# Altium schematic sheet Sheet3.SchDoc
size A4
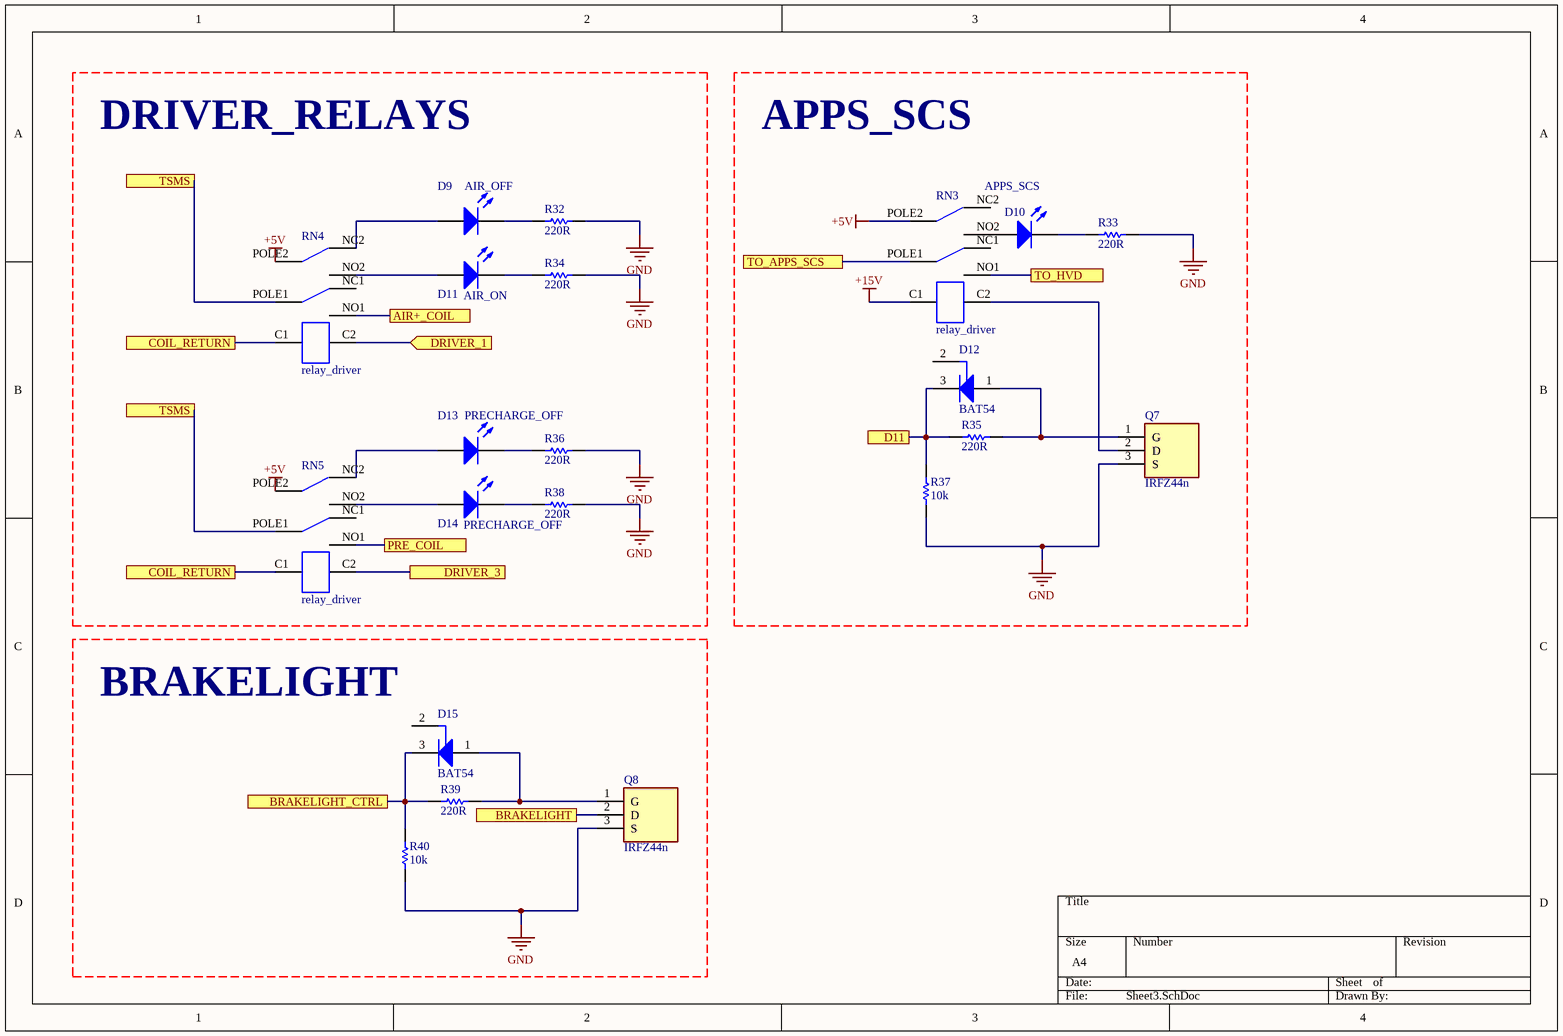
[diagram p0: Sheet3.SchDoc]

## Parts
D9  AIR_OFF  [3.2X1.6X1.1]
D10  APPS_SCS  [3.2X1.6X1.1]
D11  AIR_ON  [3.2X1.6X1.1]
D12  BAT54  [INF-SOT23_N]
D13  PRECHARGE_OFF  [3.2X1.6X1.1]
D14  PRECHARGE_OFF  [3.2X1.6X1.1]
D15  BAT54  [INF-SOT23_N]
Q7  IRFZ44n  [TO254P483X1016X2223-3P]
Q8  IRFZ44n  [TO254P483X1016X2223-3P]
R32  220R  [R1206]
R33  220R  [R1206]
R34  220R  [R1206]
R35  220R  [R1206]
R36  220R  [R1206]
R37  10k  [R1206]
R38  220R  [R1206]
R39  220R  [R1206]
R40  10k  [R1206]
RN3  relay_driver  [OMRON_12_RELAY]
RN4  relay_driver  [OMRON_12_RELAY]
RN5  relay_driver  [OMRON_12_RELAY]

## Blocks framed on the sheet
DRIVER_RELAYS: D9 D11 D13 D14 R32 R34 R36 R38 RN4 RN5
APPS_SCS: D10 D12 Q7 R33 R35 R37 RN3
BRAKELIGHT: D15 Q8 R39 R40

## Ports
AIR+_COIL, BRAKELIGHT, BRAKELIGHT_CTRL, COIL_RETURN, D11, DRIVER_1 (in), DRIVER_3, PRE_COIL, TO_APPS_SCS, TO_HVD, TSMS

## Nets
+5V: RN3.POLE2 RN4.POLE2 RN5.POLE2
+15V: RN3.C1
GND: Q7.3(S) Q8.3(S) R32.2 R33.2 R34.2 R36.2 R37.1 R38.2 R40.1
AIR+_COIL: RN4.NO1 ; port AIR+_COIL
BRAKELIGHT: Q8.2(D) ; port BRAKELIGHT
BRAKELIGHT_CTRL: D15.3(K) R39.1 R40.2 ; port BRAKELIGHT_CTRL
COIL_RETURN: RN4.C1 RN5.C1 ; port COIL_RETURN
D11: D12.3(K) R35.1 R37.2 ; port D11
DRIVER_1: RN4.C2 ; port DRIVER_1
DRIVER_3: RN5.C2 ; port DRIVER_3
PRE_COIL: RN5.NO1 ; port PRE_COIL
TO_APPS_SCS: RN3.POLE1 ; port TO_APPS_SCS
TO_HVD: RN3.NO1 ; port TO_HVD
TSMS: RN4.POLE1 RN5.POLE1 ; port TSMS
NetD9_1: D9.1(A) RN4.NC2
NetD9_2: D9.2(K) R32.1
NetD10_1: D10.1(A) RN3.NO2
NetD10_2: D10.2(K) R33.1
NetD11_1: D11.1(A) RN4.NO2
NetD11_2: D11.2(K) R34.1
NetD12_1: D12.1(A) Q7.1(G) R35.2
NetD13_1: D13.1(A) RN5.NC2
NetD13_2: D13.2(K) R36.1
NetD14_1: D14.1(A) RN5.NO2
NetD14_2: D14.2(K) R38.1
NetD15_1: D15.1(A) Q8.1(G) R39.2
NetQ7_2: Q7.2(D) RN3.C2

Not connected (* = marked no-connect by the designer): D12 2(NC); D15 2(NC); RN3 NC1 NC2; RN4 NC1; RN5 NC1

## Library data of the parts
D9-D11 D13 D14 = LED2: Typical RED, GREEN, YELLOW, AMBER GaAs LED; Published: 8-Jun-2000; LatestRevisionDate: 17-Jul-2002; LatestRevisionNote: Re-released for DXP Platform.; PackageVersion: Feb-2002; PackageReference: 3.2X1.6X1.1; Publisher: Altium Limited; PackageDescription: SM LED; 2 Flat Leads
D12 D15 = CMP-1182-00010-1: Silicon Schottky Diode, SOT23, Reel, Green; Manufacturer: Infineon; VF (max): 800Â mV; Configuration: Single; IF (max): 200Â mA; CT (max): 10Â pF; Green: TRUE; VR (max): 30Â V; PartNumber: BAT54; ComponentLink2URL: http://www.infineon.com/dgdl/bat54series.pdf?folderId=db3a30431400ef68011425f1ca2505e3&fileId=db3a304314dca3890115190b74210ea6; ComponentLink3Description: Package Specification; PackageVersion: Apr-08; PackageDescription: 3-Pin Small Outline Transistor Package, 1.3 x 2.9 mm Body, 0.95 mm Pitch; ComponentLink1Description: Manufacturer URL; ComponentLink1URL: http://www.infineon.com/; Mounting Technology: Surface Mount; Packing: Reel; ComponentLink2Description: Datasheet; PackageReference: SOT23; ComponentLink3URL: http://www.infineon.com/dgdl/SOT23-Package_Overview.pdf?folderId=db3a30431936bc4b0119532290053c66&fileId=db3a30431936bc4b0119533468123c85
Q7 Q8 = IRFZ44n: Transistor; Manufacturer_Name: Infineon; Datasheet Link: http://www.irf.com/product-info/datasheets/data/irfz44n.pdf; Height: 4.83mm; Manufacturer_Part_Number: IRFZ44n
R32-R40 = RES: Part Number: CRCW120647K0FKEA; Manufacturer: Vishay Dale